# Altium schematic sheet afstandbediening_shematic.SchDoc
size A
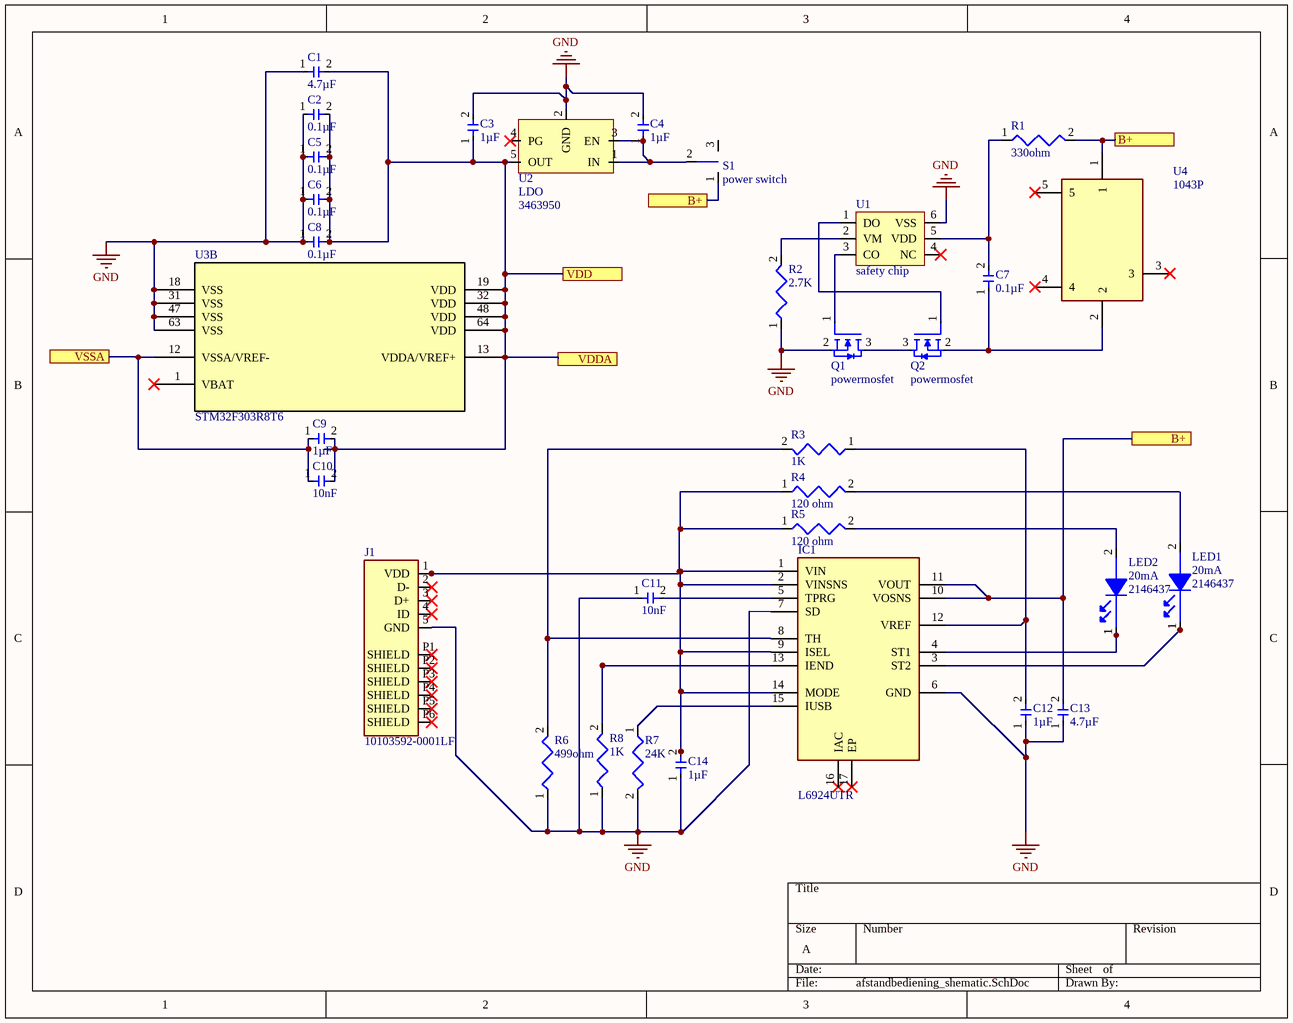
[diagram p0: afstandbediening_shematic.SchDoc]

## Parts
C1  4.7µF  [0603]
C2  0.1µF  [0603]
C3  1µF  [0603]
C4  1µF  [0603]
C5  0.1µF  [0603]
C6  0.1µF  [0603]
C7  0.1µF  [0603]
C8  0.1µF  [0603]
C9  1µF  [0603]
C10  10nF  [0603]
C11  10nF  [0603]
C12  1µF  [0603]
C13  4.7µF  [0603]
C14  1µF  [0603]
IC1  L6924UTR  [QFN50P300X300X100-17N-D]
J1  10103592-0001LF  [AMPHENOL_10103592-0001LF]
LED1  20mA  Supplier Part Number 1: 2146437  [KP-1608QBC-D]
LED2  20mA  Supplier Part Number 1: 2146437  [KP-1608QBC-D]
Q1  powermosfet  [SI2336DS-T1-GE3 - duplicate]
Q2  powermosfet  [SI2336DS-T1-GE3 - duplicate]
R1  330ohm  [MCWR08 - duplicate]
R2  2.7K  [CRCW0603]
R3  1K  [CRCW0603]
R4  120 ohm  [CRCW0603]
R5  120 ohm  [CRCW0603]
R6  499ohm  [MCWR06]
R7  24K  [MCWR06]
R8  1K  [CRCW0603]
S1  power switch  [T101MH9ABE]
U1  safety chip  [AP9101CK6-AETRG1]
U2  LDO  Supplier Part Number 1: 3463950  [NCP164C]
U3  STM32F303R8T6  [LQFP64-10x10mm]  (part B of 2)
U4  1043P  [1043P]

## Ports
B+, VDD, VDDA, VSSA

## Nets
GND: C1.1 C2.1 C3.2 C4.2 C5.1 C6.1 C8.1 C11.1 C12.1 C13.1 C14.1 IC1.6(GND) IC1.7(SD) J1.5(GND) Q1.2(S) R2.1 R6.1 R7.2 R8.1 U1.6(VSS) U2.2(GND) U3.18(VSS) U3.31(VSS) U3.47(VSS) U3.63(VSS)
B+: C13.2 IC1.10(VOSNS) IC1.11(VOUT) R1.2 S1.1 U4.1 ; port B+
VDD: C1.2 C2.2 C3.1 C5.2 C6.2 C8.2 C9.2 C10.2 U2.5(OUT) U3.13(VDDA/VREF+) U3.19(VDD) U3.32(VDD) U3.48(VDD) U3.64(VDD) ; port VDDA, port VDD
VSSA: C9.1 C10.1 U3.12(VSSA/VREF-) ; port VSSA
NetC4_1: C4.1 S1.2 U2.1(IN) U2.3(EN)
NetC7_1: C7.1 Q2.2(S) U4.2
NetC7_2: C7.2 R1.1 U1.5(VDD)
NetC11_2: C11.2 IC1.5(TPRG)
NetC12_2: C12.2 IC1.12(VREF) R3.1
NetC14_2: C14.2 IC1.1(VIN) IC1.2(VINSNS) IC1.9(ISEL) IC1.14(MODE) J1.1(VDD) R4.1 R5.1
NetIC1_3: IC1.3(ST2) LED1.1
NetIC1_4: IC1.4(ST1) LED2.1
NetIC1_8: IC1.8(TH) R3.2 R6.2
NetIC1_13: IC1.13(IEND) R8.2
NetIC1_15: IC1.15(IUSB) R7.1
NetLED1_2: LED1.2 R4.2
NetLED2_2: LED2.2 R5.2
NetQ1_1: Q1.1(G) U1.3(CO)
NetQ1_3: Q1.3(D) Q2.3(D)
NetQ2_1: Q2.1(G) U1.1(DO)
NetR2_2: R2.2 U1.2(VM)

Not connected (* = marked no-connect by the designer): IC1 16(IAC)* 17(EP)*; J1 2(D-)* 3(D+)* 4(ID)* P1(SHIELD)* P2(SHIELD)* P3(SHIELD)* P4(SHIELD)* P5(SHIELD)* P6(SHIELD)*; S1 3; U1 4(NC)*; U2 4(PG)*; U3 1(VBAT)*; U4 3* 4* 5*

## Library data of the parts
C1 C13 = 0603ZD475KAT2A: AVX - 0603ZD475KAT2A - SMD Multilayer Ceramic Capacitor, 4.7 µF, 10 V, 0603 [1608 Metric], ± 10%, X5R, AVX 0603 MLCC; Manufacturer: Kyocera AVX; Capacitance: 4.7uF; Voltage Rating: 10V; Dissipation Factor: 3.5%; Supplier 1: Farnell; Manufacturer Part Number: 0603ZD475KAT2A; RoHS: Yes; Category: Ceramic Capacitors; Stock 1: 14307; Pricing 1: 10=0.39800, 100=0.22700, 500=0.14700, 1000=0.11700, 2000=0.09810, 4000=0.08400, 20000=0.05250 (EUR); Mount: Surface Mount; Case/Package: 0603; Number of Pins: 2; Case Code (Imperial): 0603; Case Code (Metric): 1608; Contact Plating: Tin,Matte; Min Operating Temperature: -55°C; Max Operating Temperature: 85°C; Tolerance: 10%; Dielectric: X5R; Package Quantity: 1; Voltage Rating (DC): 10V; Packaging: Tape and Reel; Termination: SMD/SMT; Series: -; Voltage: 10V; Construction: Flat; Length: 1.6mm; Width: 0.81mm; Height: 0.9mm; Depth: 0.81mm; Thickness: 0.035inch; Radiation Hardening: No; REACH SVHC: No SVHC; Lead Free: Lead Free; RoHS Compliant: Yes; ComponentLink1URL: https://datasheet.ciiva.com/1458/1796776-1458211.pdf?src-supplier=Element14; ComponentLink1Description: https://datasheet.ciiva.com/1458/1796776-1458211.pdf?src-supplier=Element14; ComponentLink2URL: https://datasheet.ciiva.com/15212/getdatasheetpartid-179504-15212405.pdf?src-supplier=Verical; ComponentLink2Description: https://datasheet.ciiva.com/15212/getdatasheetpartid-179504-15212405.pdf?src-supplier=Verical; ComponentLink3URL: https://datasheet.ciiva.com/11570/cx5r-11570838.pdf?src-supplier=Avnet; ComponentLink3Description: https://datasheet.ciiva.com/11570/cx5r-11570838.pdf?src-supplier=Avnet; ComponentLink4URL: https://datasheet.ciiva.com/6269/cx5r-6269191.pdf?src-supplier=Digi-Key; ComponentLink4Description: https://datasheet.ciiva.com/6269/cx5r-6269191.pdf?src-supplier=Digi-Key; ComponentLink5URL: https://datasheet.ciiva.com/14905/cx5r-14905225.pdf?src-supplier=Digi-Key; ComponentLink5Description: https://datasheet.ciiva.com/14905/cx5r-14905225.pdf?src-supplier=Digi-Key; ComponentLink6URL: https://datasheet.ciiva.com/7855/1666675-7855114.pdf?src-supplier=Element14; ComponentLink6Description: https://datasheet.ciiva.com/7855/1666675-7855114.pdf?src-supplier=Element14; ComponentLink7URL: https://datasheet.ciiva.com/14905/cx5r-14905226.pdf?src-supplier=Digi-Key; ComponentLink7Description: https://datasheet.ciiva.com/14905/cx5r-14905226.pdf?src-supplier=Digi-Key; ComponentLink8URL: https://datasheet.ciiva.com/7614/cx5r-7614716.pdf?src-supplier=Digi-Key; ComponentLink8Description: https://datasheet.ciiva.com/7614/cx5r-7614716.pdf?src-supplier=Digi-Key; ComponentLink9URL: https://datasheet.ciiva.com/28611/1598274-28611548.pdf?src-supplier=Element14; ComponentLink9Description: https://datasheet.ciiva.com/28611/1598274-28611548.pdf?src-supplier=Element14; ComponentLink10URL: https://datasheet.ciiva.com/22700/1796776-22700575.pdf?src-supplier=Element14; ComponentLink10Description: https://datasheet.ciiva.com/22700/1796776-22700575.pdf?src-supplier=Element14; Supplier Part Number 1: 1833806
C2 C5-C8 = 0603YC104KAT2A: Cap Ceramic 0.1uF 16V X7R 10% SMD 0603 125C Paper T/R; Manufacturer: Kyocera AVX; Capacitance: 100nF; Insulation Resistance: 100GR; Dissipation Factor: 3.5%; Supplier 1: Farnell; Manufacturer Part Number: 0603YC104KAT2A; RoHS: Yes; Category: Ceramic Capacitors; Stock 1: 61599; Pricing 1: 10=0.06680, 100=0.05510, 500=0.03380, 1000=0.02430, 2000=0.02420, 4000=0.01760, 20000=0.01470 (EUR); Mount: Surface Mount,PCB; Case/Package: 0603; Number of Pins: 2; Case Code (Metric): 1608; Case Code (Imperial): 0603; Contact Plating: Tin,Matte; Min Operating Temperature: -55°C; Max Operating Temperature: 125°C; Tolerance: 10%; Dielectric: X7R; Packaging: Tape and Reel; Voltage Rating (DC): 16V; Voltage: 16V; Voltage Rating: 16V; Package Quantity: 1; Termination: SMD/SMT; Series: -; Construction: Flat; Length: 1.6mm; Width: 0.032inch; Height: 0.9mm; Depth: 0.81mm; Thickness: 0.035inch; Radiation Hardening: No; REACH SVHC: No SVHC; Lead Free: Lead Free; RoHS Compliant: Yes; ComponentLink1URL: https://datasheet.ciiva.com/11788/0900766b80dc2409-11788525.pdf?src-supplier=RSComponents; ComponentLink1Description: https://datasheet.ciiva.com/11788/0900766b80dc2409-11788525.pdf?src-supplier=RSComponents; ComponentLink2URL: https://datasheet.ciiva.com/1458/84526-1458128.pdf?src-supplier=Element14; ComponentLink2Description: https://datasheet.ciiva.com/1458/84526-1458128.pdf?src-supplier=Element14; ComponentLink3URL: https://datasheet.ciiva.com/1458/84526-1458129.pdf?src-supplier=Element14; ComponentLink3Description: https://datasheet.ciiva.com/1458/84526-1458129.pdf?src-supplier=Element14; ComponentLink4URL: https://datasheet.ciiva.com/150/cx7r-150230.pdf?src-supplier=Digi-Key; ComponentLink4Description: https://datasheet.ciiva.com/150/cx7r-150230.pdf?src-supplier=Digi-Key; ComponentLink5URL: https://datasheet.ciiva.com/28613/683218-28613286.pdf?src-supplier=Element14; ComponentLink5Description: https://datasheet.ciiva.com/28613/683218-28613286.pdf?src-supplier=Element14; ComponentLink6URL: https://datasheet.ciiva.com/150/cx7r-150231.pdf?src-supplier=Digi-Key; ComponentLink6Description: https://datasheet.ciiva.com/150/cx7r-150231.pdf?src-supplier=Digi-Key; ComponentLink7URL: https://datasheet.ciiva.com/150/cx7r-150232.pdf?src-supplier=Digi-Key; ComponentLink7Description: https://datasheet.ciiva.com/150/cx7r-150232.pdf?src-supplier=Digi-Key; ComponentLink8URL: https://datasheet.ciiva.com/5427/cx7r-218113-5427486.pdf?src-supplier=Mouser; ComponentLink8Description: https://datasheet.ciiva.com/5427/cx7r-218113-5427486.pdf?src-supplier=Mouser; ComponentLink9URL: https://datasheet.ciiva.com/14585/70001075-14585102.pdf?src-supplier=Allied+Electronics; ComponentLink9Description: https://datasheet.ciiva.com/14585/70001075-14585102.pdf?src-supplier=Allied+Electronics; ComponentLink10URL: https://datasheet.ciiva.com/11464/cx7r-11464543.pdf?src-supplier=Avnet; ComponentLink10Description: https://datasheet.ciiva.com/11464/cx7r-11464543.pdf?src-supplier=Avnet; Supplier Part Number 1: 1327679
C3 C4 C9 C12 C14 = 0603YD105KAT2A: AVX - 0603YD105KAT2A - SMD Multilayer Ceramic Capacitor, 1 µF, 16 V, 0603 [1608 Metric], ± 10%, X5R, AVX 0603 MLCC; Manufacturer: Kyocera AVX; Capacitance: 1uF; Voltage Rating: 16V; Dissipation Factor: 12.5%; Insulation Resistance: 10GR; Supplier 1: Farnell; Manufacturer Part Number: 0603YD105KAT2A; RoHS: Yes; Category: Ceramic Capacitors; Stock 1: 33961; Pricing 1: 10=0.07550, 100=0.05170, 500=0.03710, 1000=0.03000, 2000=0.02970, 4000=0.02940, 20000=0.02000 (EUR); Mount: Surface Mount; Case/Package: 0603; Number of Pins: 2; Case Code (Metric): 1608; Case Code (Imperial): 0603; Min Operating Temperature: -55°C; Max Operating Temperature: 85°C; Tolerance: 10%; Dielectric: X5R; Voltage Rating (DC): 16V; Packaging: Tape and Reel; Voltage: 16V; Package Quantity: 1; Termination: SMD/SMT; Series: -; Construction: Flat; Length: 1.6mm; Width: 0.81mm; Height: 0.9mm; Depth: 0.81mm; Thickness: 0.035inch; Radiation Hardening: No; REACH SVHC: No SVHC; Lead Free: Lead Free; RoHS Compliant: Yes; ComponentLink1URL: https://datasheet.ciiva.com/11788/0900766b80def1a5-11788563.pdf?src-supplier=RSComponents; ComponentLink1Description: https://datasheet.ciiva.com/11788/0900766b80def1a5-11788563.pdf?src-supplier=RSComponents; ComponentLink2URL: https://datasheet.ciiva.com/34303/2012654-34303835.pdf?src-supplier=Jameco; ComponentLink2Description: https://datasheet.ciiva.com/34303/2012654-34303835.pdf?src-supplier=Jameco; ComponentLink3URL: https://datasheet.ciiva.com/2987/cx5r-2987890.pdf?src-supplier=Avnet; ComponentLink3Description: https://datasheet.ciiva.com/2987/cx5r-2987890.pdf?src-supplier=Avnet; ComponentLink4URL: https://datasheet.ciiva.com/5412/cx5r-5412550.pdf?src-supplier=Mouser; ComponentLink4Description: https://datasheet.ciiva.com/5412/cx5r-5412550.pdf?src-supplier=Mouser; ComponentLink5URL: https://datasheet.ciiva.com/150/cx5r-150392.pdf?src-supplier=Digi-Key; ComponentLink5Description: https://datasheet.ciiva.com/150/cx5r-150392.pdf?src-supplier=Digi-Key; ComponentLink6URL: https://datasheet.ciiva.com/14590/70001028-14590632.pdf?src-supplier=Allied+Electronics; ComponentLink6Description: https://datasheet.ciiva.com/14590/70001028-14590632.pdf?src-supplier=Allied+Electronics; ComponentLink7URL: https://datasheet.ciiva.com/150/cx5r-150393.pdf?src-supplier=Digi-Key; ComponentLink7Description: https://datasheet.ciiva.com/150/cx5r-150393.pdf?src-supplier=Digi-Key; ComponentLink8URL: https://datasheet.ciiva.com/1458/84508-1458137.pdf?src-supplier=Element14; ComponentLink8Description: https://datasheet.ciiva.com/1458/84508-1458137.pdf?src-supplier=Element14; ComponentLink9URL: https://datasheet.ciiva.com/150/cx5r-150394.pdf?src-supplier=Digi-Key; ComponentLink9Description: https://datasheet.ciiva.com/150/cx5r-150394.pdf?src-supplier=Digi-Key; ComponentLink10URL: https://datasheet.ciiva.com/1458/84508-1458138.pdf?src-supplier=Element14; ComponentLink10Description: https://datasheet.ciiva.com/1458/84508-1458138.pdf?src-supplier=Element14; ComponentLink11URL: https://datasheet.ciiva.com/14586/70001028-14586715.pdf?src-supplier=Allied+Electronics; ComponentLink11Description: https://datasheet.ciiva.com/14586/70001028-14586715.pdf?src-supplier=Allied+Electronics; Supplier Part Number 1: 1327680
C10 C11 = 0603YC103KAT2A: AVX - 0603YC103KAT2A - SMD Multilayer Ceramic Capacitor, 10000 pF, 16 V, 0603 [1608 Metric], ± 10%, X7R, AVX 0603 MLCC; Manufacturer: Kyocera AVX; Voltage Rating (DC): 16V; Dissipation Factor: 3.5%; Supplier 1: Farnell; Manufacturer Part Number: 0603YC103KAT2A; RoHS: Yes; Category: Ceramic Capacitors; Stock 1: 10219; Pricing 1: 10=0.05050, 100=0.04160, 500=0.03270, 1000=0.02510, 2000=0.02040, 4000=0.01630, 20000=0.01090 (EUR); Mount: Surface Mount; Case/Package: 0603; Case Code (Metric): 1608; Case Code (Imperial): 0603; Min Operating Temperature: -55°C; Max Operating Temperature: 125°C; Capacitance: 10nF; Tolerance: 10%; Dielectric: X7R; Packaging: Tape and Reel; Voltage Rating: 16V; Package Quantity: 1; Termination: SMD/SMT; Voltage: 16V; Series: -; Construction: Flat; Length: 1.6mm; Width: 0.032inch; Depth: 0.81mm; Thickness: 0.035inch; Radiation Hardening: No; REACH SVHC: No SVHC; Lead Free: Lead Free; RoHS Compliant: Yes; ComponentLink1URL: https://datasheet.ciiva.com/150/cx7r-150743.pdf?src-supplier=Digi-Key; ComponentLink1Description: https://datasheet.ciiva.com/150/cx7r-150743.pdf?src-supplier=Digi-Key; ComponentLink2URL: https://datasheet.ciiva.com/22683/1679506-22683367.pdf?src-supplier=Element14; ComponentLink2Description: https://datasheet.ciiva.com/22683/1679506-22683367.pdf?src-supplier=Element14; ComponentLink3URL: https://datasheet.ciiva.com/150/cx7r-150744.pdf?src-supplier=Digi-Key; ComponentLink3Description: https://datasheet.ciiva.com/150/cx7r-150744.pdf?src-supplier=Digi-Key; ComponentLink4URL: https://datasheet.ciiva.com/150/cx7r-150745.pdf?src-supplier=Digi-Key; ComponentLink4Description: https://datasheet.ciiva.com/150/cx7r-150745.pdf?src-supplier=Digi-Key; ComponentLink5URL: https://datasheet.ciiva.com/22699/1679506-22699610.pdf?src-supplier=Element14; ComponentLink5Description: https://datasheet.ciiva.com/22699/1679506-22699610.pdf?src-supplier=Element14; ComponentLink6URL: https://datasheet.ciiva.com/5412/cx7r-218113-5412060.pdf?src-supplier=Mouser; ComponentLink6Description: https://datasheet.ciiva.com/5412/cx7r-218113-5412060.pdf?src-supplier=Mouser; ComponentLink7URL: https://datasheet.ciiva.com/7855/1679506-7855103.pdf?src-supplier=Element14; ComponentLink7Description: https://datasheet.ciiva.com/7855/1679506-7855103.pdf?src-supplier=Element14; ComponentLink8URL: https://datasheet.ciiva.com/16375/cx7r-16375919.pdf?src-supplier=Future+Electronics; ComponentLink8Description: https://datasheet.ciiva.com/16375/cx7r-16375919.pdf?src-supplier=Future+Electronics; Supplier Part Number 1: 2280661
IC1 = L6924UTR: Integrated Circuit; Manufacturer_Name: STMicroelectronics; Datasheet Link: https://componentsearchengine.com//L6924UTR.pdf; Height: 1mm; Mouser2 Part Number: 511-L6924UTR; Mouser2 Price/Stock: https://www.mouser.com/Search/Refine.aspx?Keyword=511-L6924UTR; Manufacturer_Part_Number: L6924UTR
J1 = 10103592-0001LF: USB - micro B USB 2.0 Receptacle Connector 5 Position Surface Mount, Right Angle; Through Hole; MF: Amphenol ICC; SnapEDA_Link: https://www.snapeda.com/parts/10103592-0001LF/Amphenol%20FCI/view-part/1274744/?ref=snap; Availability: Unavailable; Value: *; Price: None; MP: 10103592-0001LF; Package: None
LED1 LED2 = KP-1608QBC-D: LED Uni-Color Blue 468nm 2-Pin Chip LED T/R; Manufacturer: Kingbright; Lens Color: Clear; Viewing Angle: 120°; Lens Style: Diffused,Colorless,Circular,Rectangular; Number of LEDs: 1; Wavelength: 465nm; Luminous Intensity: 100mcd; Forward Voltage: 3.3V; Dominant Wavelength: 470nm; Supplier 1: Farnell; Manufacturer Part Number: KP-1608QBC-D; RoHS: No; Category: LEDs; Stock 1: 27050; Pricing 1: 5=0.24200, 50=0.18300, 100=0.16000, 500=0.13700, 1000=0.13400 (EUR); Mount: Surface Mount; Case/Package: 1608; Number of Pins: 2; Color: Blue; Packaging: Tape and Reel; Forward Current: 20mA; Series: KP; Length: 0.8mm; Width: 1.6mm; Height: 1.1mm; Radiation Hardening: No; REACH SVHC: No SVHC; RoHS Compliant: No; ComponentLink1URL: https://datasheet.ciiva.com/8060/1655842-8060422.pdf?src-supplier=Element14; ComponentLink1Description: https://datasheet.ciiva.com/8060/1655842-8060422.pdf?src-supplier=Element14; ComponentLink2URL: https://datasheet.ciiva.com/41454/001050379-da-01-en-smd-chipled-bl-0603-kp-1608qbc-d-41454603.pdf?src-supplier=Conrad; ComponentLink2Description: https://datasheet.ciiva.com/41454/001050379-da-01-en-smd-chipled-bl-0603-kp-1608qbc-d-41454603.pdf?src-supplier=Conrad
Q1 Q2 = SI2336DS-T1-GE3: MOSFET N-CH 30V 5.2A SOT-23; Manufacturer: Vishay Siliconix; Rds On Max: 42mR; Input Capacitance: 560pF; Gate to Source Voltage (Vgs): 8V; Element Configuration: Single; Max Power Dissipation: 1.8W; Number of Elements: 1; Power Dissipation: 1.25W; Rise Time: 10ns; Nominal Vgs: 400mV; Turn-Off Delay Time: 20ns; Turn-On Delay Time: 6ns; Polarity: N-CHANNEL; Supplier 1: Farnell; Manufacturer Part Number: SI2336DS-T1-GE3; RoHS: Yes; Category: MOSFETs; Stock 1: 10813; Pricing 1: 1=0.51400, 10=0.35200, 100=0.26600, 500=0.21000, 1000=0.18300, 5000=0.15400 (EUR); Mount: Surface Mount; Case/Package: SOT-23; Number of Pins: 3; Weight: 0.050717oz; Min Operating Temperature: -55°C; Max Operating Temperature: 150°C; Packaging: Tape and Reel; Package Quantity: 1; Continuous Drain Current (ID): 5.2A; Drain to Source Voltage (Vdss): 30V; Drain to Source Resistance: 42mR; Fall Time: 10ns; Threshold Voltage: 400mV; Number of Channels: 1; Series: TrenchFET®; REACH SVHC: No SVHC; Lead Free: Lead Free; RoHS Compliant: Yes; ComponentLink1URL: https://datasheet.ciiva.com/11160/si2336ds-11160912.pdf?src-supplier=Avnet; ComponentLink1Description: https://datasheet.ciiva.com/11160/si2336ds-11160912.pdf?src-supplier=Avnet; ComponentLink2URL: https://datasheet.ciiva.com/4440/si2336ds-260499-4440346.pdf?src-supplier=Mouser; ComponentLink2Description: https://datasheet.ciiva.com/4440/si2336ds-260499-4440346.pdf?src-supplier=Mouser; ComponentLink3URL: https://datasheet.ciiva.com/22697/1915678-22697818.pdf?src-supplier=Element14; ComponentLink3Description: https://datasheet.ciiva.com/22697/1915678-22697818.pdf?src-supplier=Element14; ComponentLink4URL: https://datasheet.ciiva.com/6373/si2336ds-6373839.pdf?src-supplier=Digi-Key; ComponentLink4Description: https://datasheet.ciiva.com/6373/si2336ds-6373839.pdf?src-supplier=Digi-Key; ComponentLink5URL: https://datasheet.ciiva.com/7788/si2336ds-7788767.pdf?src-supplier=Element14; ComponentLink5Description: https://datasheet.ciiva.com/7788/si2336ds-7788767.pdf?src-supplier=Element14; ComponentLink6URL: https://datasheet.ciiva.com/6373/si2336ds-6373836.pdf?src-supplier=Digi-Key; ComponentLink6Description: https://datasheet.ciiva.com/6373/si2336ds-6373836.pdf?src-supplier=Digi-Key; ComponentLink7URL: https://datasheet.ciiva.com/6376/si2336ds-6376271.pdf?src-supplier=Digi-Key; ComponentLink7Description: https://datasheet.ciiva.com/6376/si2336ds-6376271.pdf?src-supplier=Digi-Key; Supplier Part Number 1: 1858945
R1 = MCWR08X3300FTL: MULTICOMP         MCWR08X3300FTL            Surface Mount Chip Resistor, Thick Film, MCWR Series, 330 ohm, 125 mW,  1%, 150 V; Resistance: 330R; Power Rating: 125mW; Voltage Rating: 150V; Temperature Coefficient: 100ppm/°C; Supplier 1: Farnell; Manufacturer: Multicomp; Manufacturer Part Number: MCWR08X3300FTL; RoHS: Yes; Category: Uncategorized; Stock 1: 107956; Pricing 1: 10=0.00780, 100=0.00670, 500=0.00560, 1000=0.00410, 2500=0.00340 (EUR); Mount: Surface Mount; Case/Package: 0805; Case Code (Metric): 2012; Case Code (Imperial): 0805; Tolerance: 1%; Packaging: Tape and Reel; Resistor Type: Thick Film; Voltage Rating (DC): 150V; REACH SVHC: Unknown; ComponentLink1URL: https://datasheet.ciiva.com/46398/1849611-46398495.pdf?src-supplier=Element14; ComponentLink1Description: https://datasheet.ciiva.com/46398/1849611-46398495.pdf?src-supplier=Element14; Supplier Part Number 1: 2447638
R2 = CRCW06032K70FKEA: SMD Resistor, Thick film 2.7 kOhm,  ±  1 %, 0603, CRCW06032K70FKEA, Vishay; Tolerance: 1%; Resistance: 2.7kR; Temperature Coefficient: 100ppm/°C; Power Rating: 100mW; Voltage Rating: 75V; Supplier 1: Farnell; Manufacturer: Vishay; Manufacturer Part Number: CRCW06032K70FKEA; RoHS: Yes; Category: Chip SMD Resistors; Stock 1: 9990; Pricing 1: 10=0.02730, 100=0.01370, 500=0.01000, 1000=0.00630, 2500=0.00540, 5000=0.00480, 25000=0.00420 (EUR); Mount: Surface Mount; Case/Package: 0603; Number of Pins: 2; Case Code (Imperial): 0603; Case Code (Metric): 1608; Contact Plating: Tin,Lead; Weight: 7.1E-05oz; Min Operating Temperature: -55°C; Max Operating Temperature: 155°C; Packaging: Tape and Reel; Resistor Type: Thick Film; Termination: SMD/SMT; Number of Terminations: 2; Max Power Dissipation: 100mW; Package Quantity: 5000; Voltage Rating (DC): 75V; Features: Automotive AEC-Q200; Series: CRCW; Resistance Tolerance: 1%; Construction: Rectangular; Technology: THICK FILM; Working Voltage: 75V; Length: 1.55mm; Width: 0.85mm; Height: 0.45mm; Depth: 0.85mm; Radiation Hardening: No; RoHS Compliant: Yes; REACH SVHC: Unknown; Military Standard: Not; Lead Free: Lead Free; ComponentLink1URL: https://datasheet.ciiva.com/11809/0900766b80d98afc-11809070.pdf?src-supplier=RSComponents; ComponentLink1Description: https://datasheet.ciiva.com/11809/0900766b80d98afc-11809070.pdf?src-supplier=RSComponents; ComponentLink2URL: https://datasheet.ciiva.com/5542/dcrcwe3-109170-5542310.pdf?src-supplier=Mouser; ComponentLink2Description: https://datasheet.ciiva.com/5542/dcrcwe3-109170-5542310.pdf?src-supplier=Mouser; ComponentLink3URL: https://datasheet.ciiva.com/7841/1697337-7841580.pdf?src-supplier=Element14; ComponentLink3Description: https://datasheet.ciiva.com/7841/1697337-7841580.pdf?src-supplier=Element14; ComponentLink4URL: https://datasheet.ciiva.com/15225/getdatasheetpartid-32834-15225340.pdf?src-supplier=Verical; ComponentLink4Description: https://datasheet.ciiva.com/15225/getdatasheetpartid-32834-15225340.pdf?src-supplier=Verical; ComponentLink5URL: https://datasheet.ciiva.com/16782/70201119-16782316.pdf?src-supplier=Allied+Electronics; ComponentLink5Description: https://datasheet.ciiva.com/16782/70201119-16782316.pdf?src-supplier=Allied+Electronics; ComponentLink6URL: https://datasheet.ciiva.com/16882/dcrcw-16882972.pdf?src-supplier=Avnet+Europe; ComponentLink6Description: https://datasheet.ciiva.com/16882/dcrcw-16882972.pdf?src-supplier=Avnet+Europe; ComponentLink7URL: https://datasheet.ciiva.com/16204/dcrcwe3-16204333.pdf?src-supplier=Future+Electronics; ComponentLink7Description: https://datasheet.ciiva.com/16204/dcrcwe3-16204333.pdf?src-supplier=Future+Electronics; ComponentLink8URL: https://datasheet.ciiva.com/26314/fld-crcw-e3-data-en-26314702.pdf?src-supplier=Distrelec; ComponentLink8Description: https://datasheet.ciiva.com/26314/fld-crcw-e3-data-en-26314702.pdf?src-supplier=Distrelec; Supplier Part Number 1: 1738910
R3 R8 = CRCW06031K00JNEA: VISHAY - CRCW06031K00JNEA - SMD Chip Resistor, 0603 [1608 Metric], 1 kohm, CRCW e3 Series, 75 V, Thick Film, 100 mW; Manufacturer: Vishay Dale; Tolerance: 5%; Resistance: 1kR; Temperature Coefficient: 200ppm/°C; Power Rating: 100mW; Voltage Rating: 75V; Supplier 1: Farnell; Manufacturer Part Number: CRCW06031K00JNEA; RoHS: Yes; Category: Chip SMD Resistors; Stock 1: 180292; Pricing 1: 10=0.02520, 100=0.01160, 500=0.00900, 1000=0.00630, 2500=0.00560, 5000=0.00480, 25000=0.00420 (EUR); Case/Package: 0603; Number of Pins: 2; Contact Plating: Tin; Case Code (Metric): 1608; Case Code (Imperial): 0603; Weight: 7.1E-05oz; Size Code: 0603; Min Operating Temperature: -55°C; Max Operating Temperature: 155°C; Resistor Type: Thick Film; Packaging: Tape and Reel; Package Quantity: 1; Number of Terminations: 2; Termination: SMD/SMT; Max Power Dissipation: 100mW; Features: Automotive AEC-Q200; Series: CRCW; Construction: Rectangular; Voltage Rating (DC): 75V; Resistance Tolerance: 5%; Length: 1.55mm; Width: 0.033inch; Height: 0.02inch; Depth: 0.85mm; Radiation Hardening: No; Military Standard: Not; Lead Free: Lead Free; RoHS Compliant: Yes; REACH SVHC: Unknown; ComponentLink1URL: https://datasheet.ciiva.com/2462/dcrcwe3-2462023.pdf?src-supplier=Digi-Key; ComponentLink1Description: https://datasheet.ciiva.com/2462/dcrcwe3-2462023.pdf?src-supplier=Digi-Key; ComponentLink2URL: https://datasheet.ciiva.com/2462/dcrcwe3-2462024.pdf?src-supplier=Digi-Key; ComponentLink2Description: https://datasheet.ciiva.com/2462/dcrcwe3-2462024.pdf?src-supplier=Digi-Key; ComponentLink3URL: https://datasheet.ciiva.com/5548/dcrcwe3-109170-5548152.pdf?src-supplier=Mouser; ComponentLink3Description: https://datasheet.ciiva.com/5548/dcrcwe3-109170-5548152.pdf?src-supplier=Mouser; ComponentLink4URL: https://datasheet.ciiva.com/16515/dcrcwe3-16515080.pdf?src-supplier=Avnet+Asia; ComponentLink4Description: https://datasheet.ciiva.com/16515/dcrcwe3-16515080.pdf?src-supplier=Avnet+Asia; ComponentLink5URL: https://datasheet.ciiva.com/16211/dcrcwe3-16211589.pdf?src-supplier=Future+Electronics; ComponentLink5Description: https://datasheet.ciiva.com/16211/dcrcwe3-16211589.pdf?src-supplier=Future+Electronics; ComponentLink6URL: https://datasheet.ciiva.com/2462/dcrcwe3-2462022.pdf?src-supplier=Digi-Key; ComponentLink6Description: https://datasheet.ciiva.com/2462/dcrcwe3-2462022.pdf?src-supplier=Digi-Key; ComponentLink7URL: https://datasheet.ciiva.com/46441/1533075-46441625.pdf?src-supplier=Element14; ComponentLink7Description: https://datasheet.ciiva.com/46441/1533075-46441625.pdf?src-supplier=Element14; ComponentLink8URL: https://datasheet.ciiva.com/28621/1847332-28621386.pdf?src-supplier=Element14; ComponentLink8Description: https://datasheet.ciiva.com/28621/1847332-28621386.pdf?src-supplier=Element14; Supplier Part Number 1: 1652851
R4 R5 = CRCW0603120RFKEA: Res Thick Film 0603 120 Ohm 1% 1/10W ±100ppm/°C Molded SMD Paper T/R; Manufacturer: Vishay; Resistance: 120R; Max Power Dissipation: 100mW; Voltage Rating: 75V; Supplier 1: Farnell; Manufacturer Part Number: CRCW0603120RFKEA; RoHS: Yes; Category: Chip SMD Resistors; Stock 1: 98285; Pricing 1: 10=0.02730, 100=0.01530, 500=0.01020, 1000=0.00500, 2500=0.00450, 5000=0.00390, 25000=0.00330 (EUR); Mount: Surface Mount; Case/Package: 0603; Case Code (Metric): 1608; Case Code (Imperial): 0603; Contact Plating: Tin; Weight: 7.1E-05oz; Min Operating Temperature: -55°C; Max Operating Temperature: 155°C; Tolerance: 1%; Resistor Type: Thick Film; Temperature Coefficient: 100ppm/°C; Packaging: Tape and Reel; Number of Terminations: 2; Package Quantity: 10; Power Rating: 100mW; Termination: SMD/SMT; Features: Automotive AEC-Q200; Series: CRCW; Technology: THICK FILM; Construction: Rectangular; Resistance Tolerance: 1%; Voltage Rating (DC): 75V; Working Voltage: 75V; Length: 1.55mm; Width: 0.033inch; Height: 0.45mm; Depth: 0.85mm; Radiation Hardening: No; RoHS Compliant: Yes; REACH SVHC: Unknown; Military Standard: Not; Lead Free: Lead Free; ComponentLink1URL: https://datasheet.ciiva.com/11811/0900766b80d98afc-11811523.pdf?src-supplier=RSComponents; ComponentLink1Description: https://datasheet.ciiva.com/11811/0900766b80d98afc-11811523.pdf?src-supplier=RSComponents; ComponentLink2URL: https://datasheet.ciiva.com/2513/dcrcwe3-2513575.pdf?src-supplier=Digi-Key; ComponentLink2Description: https://datasheet.ciiva.com/2513/dcrcwe3-2513575.pdf?src-supplier=Digi-Key; ComponentLink3URL: https://datasheet.ciiva.com/2513/dcrcwe3-2513576.pdf?src-supplier=Digi-Key; ComponentLink3Description: https://datasheet.ciiva.com/2513/dcrcwe3-2513576.pdf?src-supplier=Digi-Key; ComponentLink4URL: https://datasheet.ciiva.com/26316/fld-crcw-e3-data-en-26316568.pdf?src-supplier=Distrelec; ComponentLink4Description: https://datasheet.ciiva.com/26316/fld-crcw-e3-data-en-26316568.pdf?src-supplier=Distrelec; ComponentLink5URL: https://datasheet.ciiva.com/2513/dcrcwe3-2513577.pdf?src-supplier=Digi-Key; ComponentLink5Description: https://datasheet.ciiva.com/2513/dcrcwe3-2513577.pdf?src-supplier=Digi-Key; ComponentLink6URL: https://datasheet.ciiva.com/5544/dcrcwe3-109170-5544139.pdf?src-supplier=Mouser; ComponentLink6Description: https://datasheet.ciiva.com/5544/dcrcwe3-109170-5544139.pdf?src-supplier=Mouser; ComponentLink7URL: https://datasheet.ciiva.com/7777/1533075-7777275.pdf?src-supplier=Element14; ComponentLink7Description: https://datasheet.ciiva.com/7777/1533075-7777275.pdf?src-supplier=Element14; ComponentLink8URL: https://datasheet.ciiva.com/7777/1697337-7777276.pdf?src-supplier=Element14; ComponentLink8Description: https://datasheet.ciiva.com/7777/1697337-7777276.pdf?src-supplier=Element14; ComponentLink9URL: https://datasheet.ciiva.com/16725/70201119-16725181.pdf?src-supplier=Allied+Electronics; ComponentLink9Description: https://datasheet.ciiva.com/16725/70201119-16725181.pdf?src-supplier=Allied+Electronics; Supplier Part Number 1: 1652832
R6 = MCWR06X4990FTL: Res, 499R, 1%, 0.1W, 0603, Thick Film; Manufacturer: Multicomp; Supplier 1: Farnell; Manufacturer Part Number: MCWR06X4990FTL; RoHS: Yes; Stock 1: 34389; Pricing 1: 10=0.00450, 100=0.00410, 500=0.00370, 1000=0.00330, 2500=0.00240 (EUR); Supplier Part Number 1: 2694886
R7 = MCWR06X2402FTL: MULTICOMP - MCWR06X2402FTL - RES, 24K, 1%, 0.1W, THICK FILM; Resistance: 24kR; Power Rating: 100mW; Voltage Rating: 50V; Temperature Coefficient: 100ppm/°C; Supplier 1: Farnell; Manufacturer: Multicomp; Manufacturer Part Number: MCWR06X2402FTL; RoHS: Yes; Stock 1: 22057; Pricing 1: 10=0.00510, 100=0.00470, 500=0.00420, 1000=0.00380, 2500=0.00230 (EUR); Case/Package: 0603; Case Code (Imperial): 0603; Case Code (Metric): 1608; Tolerance: 1%; Packaging: Tape and Reel; Voltage Rating (DC): 50V; Resistor Type: Thick Film; REACH SVHC: Unknown; ComponentLink1URL: http://www.farnell.com/datasheets/2563624.pdf?src-supplier=Farnell; ComponentLink1Description: http://www.farnell.com/datasheets/2563624.pdf?src-supplier=Farnell; ComponentLink2URL: http://www.farnell.com/datasheets/1849611.pdf?src-supplier=Element14; ComponentLink2Description: http://www.farnell.com/datasheets/1849611.pdf?src-supplier=Element14; Supplier Part Number 1: 2447308
S1 = T101MH9ABE: SWITCH TOGGLE SPDT 0.4VA 20V; Manufacturer: ITT C&K; Actuator Material: Brass,Chrome; Actuator Color: Chrome; Contact Current Rating: 400mA; Contact Resistance: 20mR; Number of Poles: 1; Power Rating: 400mW; Illumination Type: Non-Illuminated,Illuminated; Electrical Life: 60000Cycles; Current Rating: 20mA; Switch Function: On-On; Actuator Type: Standard Round; Actuator Length: 5.33mm; Supplier 1: Farnell; Manufacturer Part Number: T101MH9ABE; RoHS: Yes; Category: Toggle Switches; Stock 1: 304; Pricing 1: 1=5.00000, 5=4.75000, 10=4.50000, 20=4.30000, 50=4.09000 (EUR); Mount: Through Hole,Brackets,PCB; Contact Material: Gold,Copper Alloy; Contact Plating: Gold,Nickel; Housing Material: Stainless Steel; Min Operating Temperature: -30°C; Max Operating Temperature: 85°C; Throw Configuration: SPDT; Max Voltage Rating (DC): 20V; Termination: PC Pins; Voltage Rating (AC): 20V; Voltage Rating (DC): 20V; Packaging: Bulk; Max Voltage Rating (AC): 20V; Package Quantity: 1; Orientation: Right Angle; Series: T; Length: 8.13mm; Width: 8.1mm; Height: 5mm; Radiation Hardening: No; REACH SVHC: No SVHC; Lead Free: Lead Free; RoHS Compliant: Yes; ComponentLink1URL: https://datasheet.ciiva.com/7986/49548-7986817.pdf?src-supplier=Element14; ComponentLink1Description: https://datasheet.ciiva.com/7986/49548-7986817.pdf?src-supplier=Element14; ComponentLink2URL: https://datasheet.ciiva.com/19467/595956-19467316.pdf?src-supplier=Jameco; ComponentLink2Description: https://datasheet.ciiva.com/19467/595956-19467316.pdf?src-supplier=Jameco; ComponentLink3URL: https://datasheet.ciiva.com/18143/getdatasheetpartid-116123-18143142.pdf?src-supplier=Verical; ComponentLink3Description: https://datasheet.ciiva.com/18143/getdatasheetpartid-116123-18143142.pdf?src-supplier=Verical; ComponentLink4URL: https://datasheet.ciiva.com/2906/t-toggle-29jul14-2906940.pdf?src-supplier=Digi-Key; ComponentLink4Description: https://datasheet.ciiva.com/2906/t-toggle-29jul14-2906940.pdf?src-supplier=Digi-Key; ComponentLink5URL: https://datasheet.ciiva.com/7986/1695318-7986815.pdf?src-supplier=Element14; ComponentLink5Description: https://datasheet.ciiva.com/7986/1695318-7986815.pdf?src-supplier=Element14; Supplier Part Number 1: 9575685
U1 = AP9101CK6-AETRG1: IC BATT PROT LI-ION 1-CELL SOT26; Manufacturer: Diodes; Number of Cells: 1; Fault Protection: Over Current,Over Voltage; Supplier 1: Mouser; Manufacturer Part Number: AP9101CK6-AETRG1; RoHS: Yes; Category: Battery Management; Stock 1: 3466; Pricing 1: 1=0.44000, 10=0.32300, 50=0.32300, 100=0.16500, 1000=0.12400, 10000=0.10700 (USD); Case/Package: SOT-23-6; Min Operating Temperature: -40°C; Max Operating Temperature: 85°C; RoHS Compliant: Yes; ComponentLink1URL: https://www.diodes.com/assets/Datasheets/AP9101C.pdf?src-supplier=Digi-Key; ComponentLink1Description: https://www.diodes.com/assets/Datasheets/AP9101C.pdf?src-supplier=Digi-Key; Supplier Part Number 1: 621-AP9101CK6-AETRG1
U2 = NCP164CSN300T1G: MAX 5V, MIN 1.6V OUTPUT 3V; Manufacturer: ON Semiconductor; Supplier 1: Farnell; Manufacturer Part Number: NCP164CSN300T1G; RoHS: No; Stock 1: 3000; Pricing 1: 1=0.39400, 50=0.32400, 100=0.25600, 250=0.23300, 500=0.22700, 1000=0.19200, 2500=0.17300, 5000=0.16700 (EUR)
U3 = STM32F303R8T6: No Description Available; Vendor: STMicroelectronics; Built_By: EMA_UL_Team; SourceLibrary: Updates_to_database_2020-10-19; Manufacturer_Part_Number: STM32F303R8T6; Copyright: Copyright (C) 2018 Accelerated Designs. All rights reserved; RefDes: RefDes; Type: DEV
U4 = 1043P: Undefined or Miscellaneous; Manufacturer_Name: Keystone Electronics; Datasheet Link: http://www.keyelco.com/product-pdf.cfm?p=13958; Height: 14mm; Manufacturer_Part_Number: 1043P